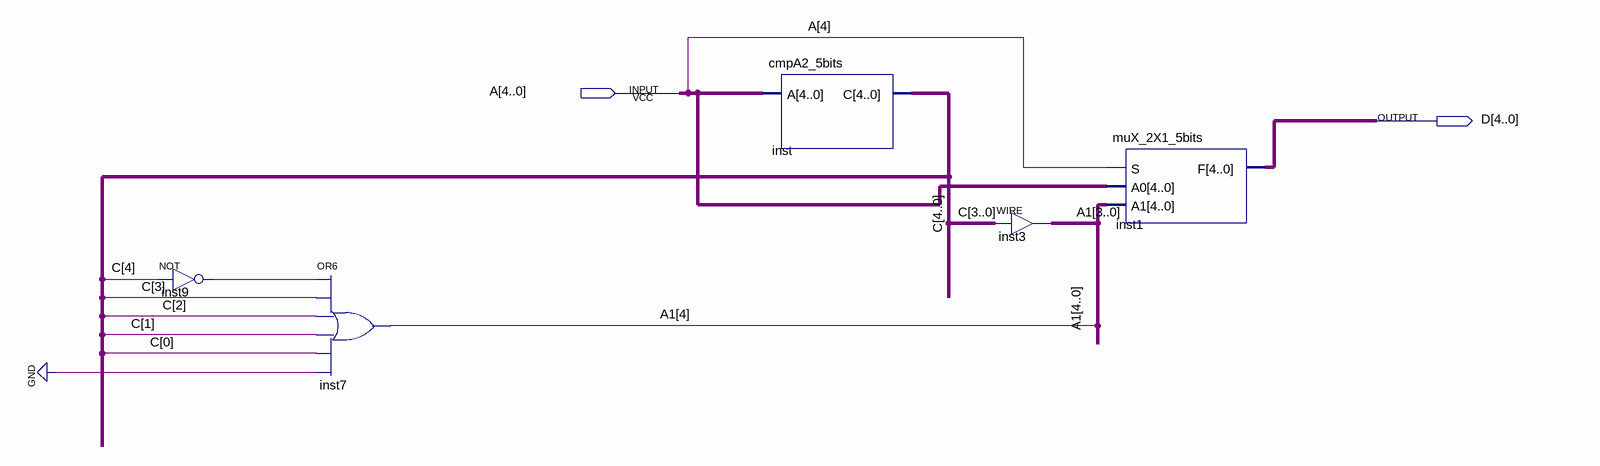
[diagram p0: schematic sheet]
// Quartus schematic FixEntrada.bdf as structural Verilog: 5 symbols, 2 pins
module FixEntrada (
  input  [4:0] A,
  output [4:0] D
);

  wire inst9_out;
  wire [4:0] A1, C;

  not inst9 (inst9_out, C[4]);
  or inst7 (A1[4], inst9_out, C[3], C[2], C[1], C[0], 1'b0);
  cmpA2_5bits inst (.A(A), .C(C));
  assign A1[3:0] = C[3:0];  // WIRE inst3
  muX_2X1_5bits inst1 (.S(A[4]), .A0(A), .A1(A1), .F(D));
endmodule
